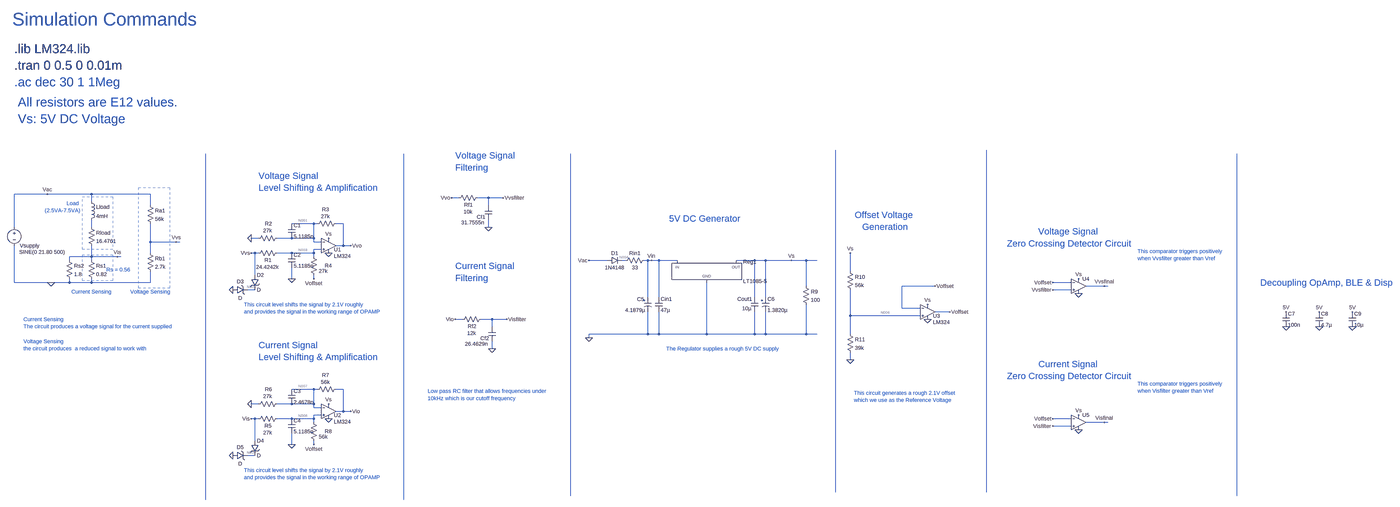
[diagram p0: schematic LTspice.asc, whole sheet]
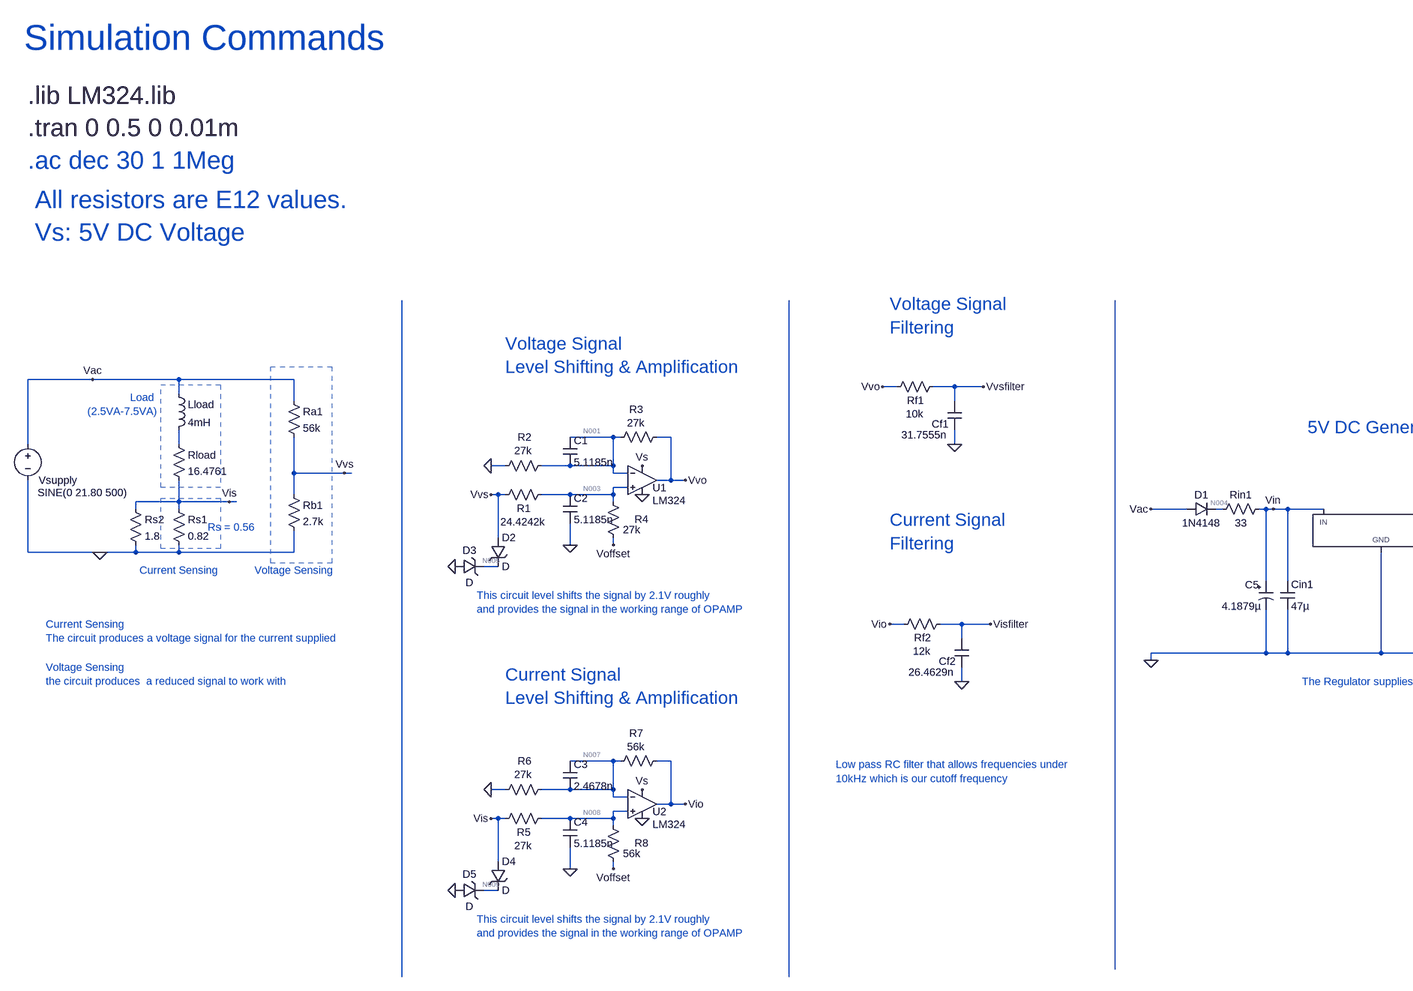
[diagram p1: schematic LTspice.asc, part, row 1 of 1, column 1 of 2]
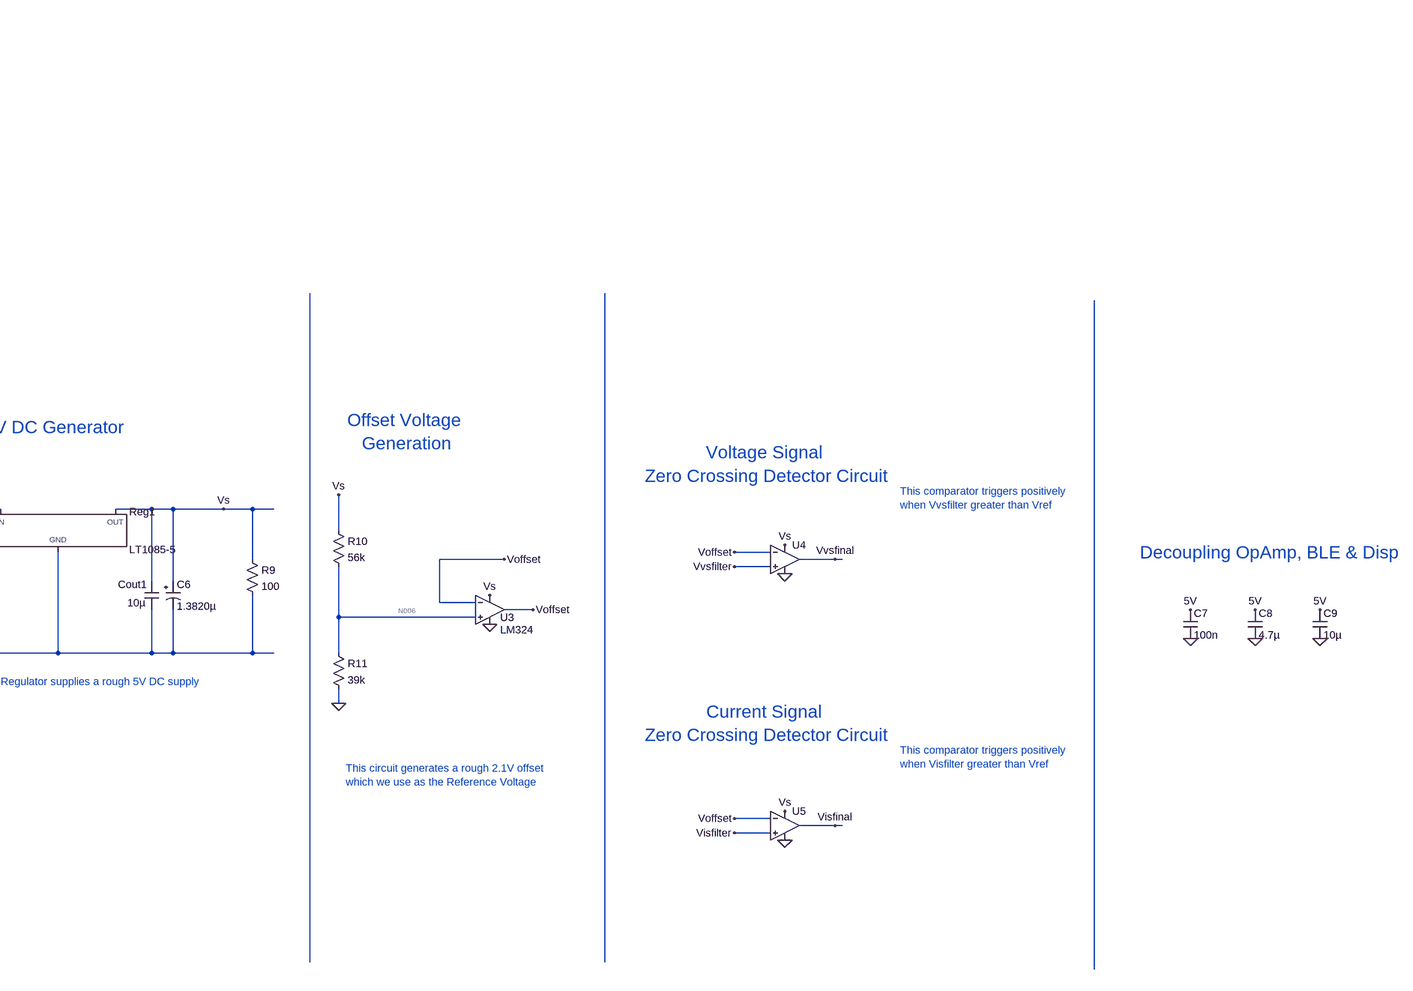
[diagram p2: schematic LTspice.asc, part, row 1 of 1, column 2 of 2]
LTspice.asc, the LTspice schematic file:
Version 4
SHEET 1 6052 1304
WIRE -96 -48 -240 -48
WIRE 96 -48 -96 -48
WIRE 352 -48 96 -48
WIRE 1856 -32 1824 -32
WIRE 1984 -32 1936 -32
WIRE 2048 -32 1984 -32
WIRE 96 -16 96 -48
WIRE 352 0 352 -48
WIRE 1984 0 1984 -32
WIRE 1072 80 976 80
WIRE 1088 80 1072 80
WIRE 1200 80 1168 80
WIRE -240 96 -240 -48
WIRE 96 96 96 64
WIRE 1984 96 1984 64
WIRE 832 144 800 144
WIRE 976 144 912 144
WIRE 1072 144 1072 80
WIRE 1072 144 976 144
WIRE 352 160 352 80
WIRE 464 160 352 160
WIRE 480 160 464 160
WIRE 1072 160 1072 144
WIRE 1104 160 1072 160
WIRE 1200 176 1200 80
WIRE 1200 176 1168 176
WIRE 1232 176 1200 176
WIRE 1104 192 1072 192
WIRE 352 208 352 160
WIRE 816 208 800 208
WIRE 832 208 816 208
WIRE 976 208 912 208
WIRE 1072 208 1072 192
WIRE 1072 208 976 208
WIRE 96 224 96 176
WIRE 96 224 0 224
WIRE 208 224 96 224
WIRE 224 224 208 224
WIRE 1072 224 1072 208
WIRE 0 240 0 224
WIRE 96 240 96 224
WIRE 2544 240 2464 240
WIRE 2624 240 2608 240
WIRE 2720 240 2704 240
WIRE 2736 240 2720 240
WIRE 2768 240 2736 240
WIRE 2848 240 2768 240
WIRE 3184 240 3104 240
WIRE 3232 240 3184 240
WIRE 3344 240 3232 240
WIRE 3408 240 3344 240
WIRE 3456 240 3408 240
WIRE 3600 288 3600 208
WIRE 816 304 816 208
WIRE 976 320 976 272
WIRE 1072 320 1072 304
WIRE -240 336 -240 176
WIRE -80 336 -240 336
WIRE 0 336 0 320
WIRE 0 336 -80 336
WIRE 96 336 96 320
WIRE 96 336 0 336
WIRE 352 336 352 288
WIRE 352 336 96 336
WIRE 4560 336 4480 336
WIRE 3408 352 3408 240
WIRE 3968 352 3824 352
WIRE 4704 352 4624 352
WIRE 4720 352 4704 352
WIRE 816 368 784 368
WIRE 4560 368 4480 368
WIRE 2720 400 2720 240
WIRE 2768 400 2768 240
WIRE 3184 400 3184 240
WIRE 3232 400 3232 240
WIRE 3824 448 3824 352
WIRE 3904 448 3824 448
WIRE 4032 464 3968 464
WIRE 3600 480 3600 368
WIRE 3904 480 3600 480
WIRE 1872 496 1840 496
WIRE 2000 496 1952 496
WIRE 2064 496 2000 496
WIRE 2000 528 2000 496
WIRE 2720 560 2720 464
WIRE 2720 560 2464 560
WIRE 2768 560 2768 464
WIRE 2768 560 2720 560
WIRE 2976 560 2976 336
WIRE 2976 560 2768 560
WIRE 3184 560 3184 464
WIRE 3184 560 2976 560
WIRE 3232 560 3232 464
WIRE 3232 560 3184 560
WIRE 3408 560 3408 432
WIRE 3408 560 3232 560
WIRE 3456 560 3408 560
WIRE 3600 560 3600 480
WIRE 2464 576 2464 560
WIRE 2000 624 2000 592
WIRE 3600 672 3600 640
WIRE 1072 800 976 800
WIRE 1088 800 1072 800
WIRE 1200 800 1168 800
WIRE 832 864 800 864
WIRE 976 864 912 864
WIRE 1072 864 1072 800
WIRE 1072 864 976 864
WIRE 1072 880 1072 864
WIRE 1104 880 1072 880
WIRE 1200 896 1200 800
WIRE 1200 896 1168 896
WIRE 1232 896 1200 896
WIRE 1104 912 1072 912
WIRE 816 928 800 928
WIRE 832 928 816 928
WIRE 976 928 912 928
WIRE 1072 928 1072 912
WIRE 1072 928 976 928
WIRE 4560 928 4480 928
WIRE 1072 944 1072 928
WIRE 4704 944 4624 944
WIRE 4720 944 4704 944
WIRE 4560 960 4480 960
WIRE 816 1024 816 928
WIRE 976 1040 976 992
WIRE 1072 1040 1072 1024
WIRE 816 1088 784 1088
WIRE 3536 1248 3536 -240
WIRE 4192 1248 4192 -240
WIRE 2384 1264 2384 -224
WIRE 5280 1264 5280 -224
WIRE 592 1280 592 -224
WIRE 1616 1280 1616 -224
FLAG -80 336 0
FLAG -96 -48 Vac
FLAG 208 224 Vis
FLAG 464 160 Vvs
FLAG 1136 208 0
FLAG 1136 144 Vs
FLAG 800 208 Vvs
FLAG 1072 320 Voffset
FLAG 800 144 0
FLAG 1232 176 Vvo
FLAG 1136 928 0
FLAG 1136 864 Vs
FLAG 800 928 Vis
FLAG 1072 1040 Voffset
FLAG 800 864 0
FLAG 1232 896 Vio
FLAG 1984 96 0
FLAG 1824 -32 Vvo
FLAG 2048 -32 Vvsfilter
FLAG 2000 624 0
FLAG 1840 496 Vio
FLAG 2064 496 Visfilter
FLAG 3600 208 Vs
FLAG 4592 384 0
FLAG 4592 320 Vs
FLAG 4480 368 Vvsfilter
FLAG 4480 336 Voffset
FLAG 4704 352 Vvsfinal
FLAG 2464 576 0
FLAG 2464 240 Vac
FLAG 3344 240 Vs
FLAG 2736 240 Vin
FLAG 3936 496 0
FLAG 3936 432 Vs
FLAG 3600 672 0
FLAG 4032 464 Voffset
FLAG 4592 976 0
FLAG 4592 912 Vs
FLAG 4480 960 Visfilter
FLAG 4480 928 Voffset
FLAG 4704 944 Visfinal
FLAG 3968 352 Voffset
FLAG 976 320 0
FLAG 976 1040 0
FLAG 720 368 0
FLAG 720 1088 0
FLAG 5504 528 0
FLAG 5648 528 0
FLAG 5792 528 0
FLAG 5504 464 5V
FLAG 5648 464 5V
FLAG 5792 464 5V
SYMBOL voltage -240 80 R0
WINDOW 0 24 96 Left 2
WINDOW 3 22 124 Left 2
WINDOW 123 0 0 Left 0
WINDOW 39 0 0 Left 0
SYMATTR InstName Vsupply
SYMATTR Value SINE(0 21.80 500)
SYMBOL res 80 80 R0
SYMATTR InstName Rload
SYMATTR Value 16.4761
SYMBOL ind 80 -32 R0
SYMATTR InstName Lload
SYMATTR Value 4mH
SYMBOL res 80 224 R0
SYMATTR InstName Rs1
SYMATTR Value 0.82
SYMBOL res 336 -16 R0
SYMATTR InstName Ra1
SYMATTR Value 56k
SYMBOL res 336 192 R0
SYMATTR InstName Rb1
SYMATTR Value 2.7k
SYMBOL Opamps/opamp2 1136 112 R0
WINDOW 0 23 81 Left 2
WINDOW 3 23 109 Left 2
SYMATTR InstName U1
SYMATTR Value LM324
SYMBOL res 928 192 R90
WINDOW 0 62 55 VBottom 2
WINDOW 3 61 57 VTop 2
SYMATTR InstName R1
SYMATTR Value 24.4242k
SYMBOL res 928 128 R90
WINDOW 0 -32 53 VBottom 2
WINDOW 3 -33 57 VTop 2
SYMATTR InstName R2
SYMATTR Value 27k
SYMBOL res 1184 64 R90
WINDOW 0 -30 61 VBottom 2
WINDOW 3 -31 62 VTop 2
SYMATTR InstName R3
SYMATTR Value 27k
SYMBOL res 1088 320 R180
WINDOW 0 -62 57 Left 2
WINDOW 3 -44 34 Left 2
SYMATTR InstName R4
SYMATTR Value 27k
SYMBOL Opamps/opamp2 1136 832 R0
WINDOW 0 23 81 Left 2
WINDOW 3 23 109 Left 2
SYMATTR InstName U2
SYMATTR Value LM324
SYMBOL res 928 912 R90
WINDOW 0 62 55 VBottom 2
WINDOW 3 61 57 VTop 2
SYMATTR InstName R5
SYMATTR Value 27k
SYMBOL res 928 848 R90
WINDOW 0 -32 53 VBottom 2
WINDOW 3 -33 57 VTop 2
SYMATTR InstName R6
SYMATTR Value 27k
SYMBOL res 1184 784 R90
WINDOW 0 -30 61 VBottom 2
WINDOW 3 -31 62 VTop 2
SYMATTR InstName R7
SYMATTR Value 56k
SYMBOL res 1088 1040 R180
WINDOW 0 -62 57 Left 2
WINDOW 3 -44 34 Left 2
SYMATTR InstName R8
SYMATTR Value 56k
SYMBOL res 1952 -48 R90
WINDOW 0 62 55 VBottom 2
WINDOW 3 61 57 VTop 2
SYMATTR InstName Rf1
SYMATTR Value 10k
SYMBOL cap 2000 64 R180
WINDOW 0 29 13 Left 2
WINDOW 3 33 -11 Left 2
SYMATTR InstName Cf1
SYMATTR Value 31.7555n
SYMBOL res 1968 480 R90
WINDOW 0 62 55 VBottom 2
WINDOW 3 61 57 VTop 2
SYMATTR InstName Rf2
SYMATTR Value 12k
SYMBOL cap 2016 592 R180
WINDOW 0 29 13 Left 2
WINDOW 3 33 -11 Left 2
SYMATTR InstName Cf2
SYMATTR Value 26.4629n
SYMBOL OpAmps/UniversalOpAmp2 4592 352 R0
SYMATTR InstName U4
SYMBOL PowerProducts/LT1085-5 2976 240 R0
SYMATTR InstName Reg1
SYMBOL res 2720 224 R90
WINDOW 0 0 56 VBottom 2
WINDOW 3 32 56 VTop 2
SYMATTR InstName Rin1
SYMATTR Value 33
SYMBOL diode 2544 256 R270
WINDOW 0 32 32 VTop 2
WINDOW 3 0 32 VBottom 2
SYMATTR InstName D1
SYMATTR Value 1N4148
SYMBOL cap 2752 400 R0
SYMATTR InstName Cin1
SYMATTR Value 47µ
SYMATTR SpiceLine Rser=0.001
SYMBOL cap 3168 400 R0
WINDOW 0 -59 8 Left 2
WINDOW 3 -38 49 Left 2
SYMATTR InstName Cout1
SYMATTR Value 10µ
SYMATTR SpiceLine Rser=0.001
SYMBOL res 3392 336 R0
SYMATTR InstName R9
SYMATTR Value 100
SYMBOL Opamps/opamp2 3936 400 R0
WINDOW 0 23 81 Left 2
WINDOW 3 23 109 Left 2
SYMATTR InstName U3
SYMATTR Value LM324
SYMBOL res 3584 272 R0
SYMATTR InstName R10
SYMATTR Value 56k
SYMBOL res 3584 544 R0
SYMATTR InstName R11
SYMATTR Value 39k
SYMBOL OpAmps/UniversalOpAmp2 4592 944 R0
SYMATTR InstName U5
SYMBOL cap 960 80 R0
SYMATTR InstName C1
SYMATTR Value 5.1185n
SYMBOL cap 960 208 R0
SYMATTR InstName C2
SYMATTR Value 5.1185n
SYMBOL res -16 224 R0
SYMATTR InstName Rs2
SYMATTR Value 1.8
SYMBOL cap 960 800 R0
SYMATTR InstName C3
SYMATTR Value 2.4678n
SYMBOL cap 960 928 R0
SYMATTR InstName C4
SYMATTR Value 5.1185n
SYMBOL polcap 2704 400 R0
WINDOW 0 -31 9 Left 2
WINDOW 3 -82 56 Left 2
SYMATTR InstName C5
SYMATTR Value 4.1879µ
SYMBOL polcap 3216 400 R0
SYMATTR InstName C6
SYMATTR Value 1.3820µ
SYMBOL zener 800 304 R0
SYMATTR InstName D2
SYMBOL zener 720 384 R270
WINDOW 0 36 32 VTop 2
WINDOW 3 -4 32 VBottom 2
SYMATTR InstName D3
SYMBOL zener 800 1024 R0
SYMATTR InstName D4
SYMBOL zener 720 1104 R270
WINDOW 0 36 32 VTop 2
WINDOW 3 -4 32 VBottom 2
SYMATTR InstName D5
SYMBOL cap 5488 464 R0
SYMATTR InstName C7
SYMATTR Value 100n
SYMBOL cap 5632 464 R0
SYMATTR InstName C8
SYMATTR Value 4.7µ
SYMBOL cap 5776 464 R0
SYMATTR InstName C9
SYMATTR Value 10µ
TEXT 48 -8 Right 2 ;Load \n(2.5VA-7.5VA)
TEXT -200 496 Left 2 ;Current Sensing                                \nThe circuit produces a voltage signal for the current supplied
TEXT -200 592 Left 2 ;Voltage Sensing\nthe circuit produces  a reduced signal to work with
TEXT 832 -128 Left 4 ;Voltage Signal \nLevel Shifting & Amplification
TEXT 768 432 Left 2 ;This circuit level shifts the signal by 2.1V roughly \nand provides the signal in the working range of OPAMP
TEXT 768 1152 Left 2 ;This circuit level shifts the signal by 2.1V roughly \nand provides the signal in the working range of OPAMP
TEXT 1840 -216 Left 4 ;Voltage Signal\nFiltering
TEXT 1840 264 Left 4 ;Current Signal\nFiltering
TEXT 1720 808 Left 2 ;Low pass RC filter that allows frequencies under \n10kHz which is our cutoff frequency
TEXT 3752 16 Top 4 ;Offset Voltage \nGeneration
TEXT 3616 816 Left 2 ;This circuit generates a rough 2.1V offset \nwhich we use as the Reference Voltage
TEXT 4552 88 Top 4 ;Voltage Signal \nZero Crossing Detector Circuit
TEXT 2968 32 Top 4 ;5V DC Generator
TEXT 2800 624 Left 2 ;The Regulator supplies a rough 5V DC supply
TEXT 8 376 Left 2 ;Current Sensing
TEXT 264 376 Left 2 ;Voltage Sensing
TEXT 832 608 Left 4 ;Current Signal \nLevel Shifting & Amplification
TEXT -248 -816 Left 6 ;Simulation Commands
TEXT -240 -688 Left 5 !.lib LM324.lib
TEXT -240 -616 Left 5 !.tran 0 0.5 0 0.01m
TEXT -240 -544 Left 5 ;.ac dec 30 1 1Meg
TEXT 4848 200 Left 2 ;This comparator triggers positively \nwhen Vvsfilter greater than Vref
TEXT 4848 776 Left 2 ;This comparator triggers positively \nwhen Visfilter greater than Vref
TEXT 4552 664 Top 4 ;Current Signal \nZero Crossing Detector Circuit
TEXT -224 -384 Left 5 ;Vs: 5V DC Voltage
TEXT -224 -456 Left 5 ;All resistors are E12 values.
TEXT 160 280 Left 2 ;Rs = 0.56
TEXT 5392 336 Left 4 ;Decoupling OpAmp, BLE & Disp
RECTANGLE Normal 300 -76 436 360 2
RECTANGLE Normal 56 -36 188 192 2
RECTANGLE Normal 56 216 188 328 2

The netlist it stands for:
* LTspice.asc
Vsupply Vac 0 SINE(0 21.80 500)
Rload N002 Vis 16.4761
Lload Vac N002 4mH
Rs1 Vis 0 0.82
Ra1 Vac Vvs 56k
Rb1 Vvs 0 2.7k
XU1 N003 N001 Vs 0 Vvo LM324  ; pins In+ In- V+ V- OUT
R1 N003 Vvs 24.4242k
R2 N001 0 27k
R3 Vvo N001 27k
R4 Voffset N003 27k
XU2 N008 N007 Vs 0 Vio LM324  ; pins In+ In- V+ V- OUT
R5 N008 Vis 27k
R6 N007 0 27k
R7 Vio N007 56k
R8 Voffset N008 56k
Rf1 Vvsfilter Vvo 10k
Cf1 0 Vvsfilter 31.7555n
Rf2 Visfilter Vio 12k
Cf2 0 Visfilter 26.4629n
XU4 Vvsfilter Voffset Vs 0 Vvsfinal level2 Avol=1Meg GBW=10Meg Slew=10Meg Ilimit=25m Rail=0 Vos=0 En=0 Enk=0 In=0 Ink=0 Rin=500Meg  ; pins In+ In- V+ V- OUT
XReg1 0 Vs Vin LT1085-5  ; pins GND OUT IN
Rin1 Vin N004 33
D1 Vac N004 1N4148
Cin1 Vin 0 47µ Rser=0.001
Cout1 Vs 0 10µ Rser=0.001
R9 Vs 0 100
XU3 N006 Voffset Vs 0 Voffset LM324  ; pins In+ In- V+ V- OUT
R10 Vs N006 56k
R11 N006 0 39k
XU5 Visfilter Voffset Vs 0 Visfinal level2 Avol=1Meg GBW=10Meg Slew=10Meg Ilimit=25m Rail=0 Vos=0 En=0 Enk=0 In=0 Ink=0 Rin=500Meg  ; pins In+ In- V+ V- OUT
C1 N001 N001 5.1185n
C2 N003 0 5.1185n
Rs2 Vis 0 1.8
C3 N007 N007 2.4678n
C4 N008 0 5.1185n
C5 Vin 0 4.1879µ
C6 Vs 0 1.3820µ
D2 Vvs N005 D
D3 0 N005 D
D4 Vis N009 D
D5 0 N009 D
C7 5V 0 100n
C8 5V 0 4.7µ
C9 5V 0 10µ
.model D D
.lib standard.dio
* Load
* (2.5VA-7.5VA)
* Current Sensing
* The circuit produces a voltage signal for the current supplied
* Voltage Sensing
* the circuit produces  a reduced signal to work with
* Voltage Signal
* Level Shifting & Amplification
* This circuit level shifts the signal by 2.1V roughly
* and provides the signal in the working range of OPAMP
* This circuit level shifts the signal by 2.1V roughly
* and provides the signal in the working range of OPAMP
* Voltage Signal
* Filtering
* Current Signal
* Filtering
* Low pass RC filter that allows frequencies under
* 10kHz which is our cutoff frequency
* Offset Voltage
* Generation
* This circuit generates a rough 2.1V offset
* which we use as the Reference Voltage
* Voltage Signal
* Zero Crossing Detector Circuit
* 5V DC Generator
* The Regulator supplies a rough 5V DC supply
* Current Sensing
* Voltage Sensing
* Current Signal
* Level Shifting & Amplification
* Simulation Commands
.lib LM324.lib
.tran 0 0.5 0 0.01m
* .ac dec 30 1 1Meg
* This comparator triggers positively
* when Vvsfilter greater than Vref
* This comparator triggers positively
* when Visfilter greater than Vref
* Current Signal
* Zero Crossing Detector Circuit
* Vs: 5V DC Voltage
* All resistors are E12 values.
* Rs = 0.56
* Decoupling OpAmp, BLE & Disp
.lib UniversalOpAmp2.lib
.backanno
.end

* Results of the author's LTspice run, read from the files saved beside the schematic
* Operating Point, zero values left out:
*   V(vis) = -1.035 µV
*   V(vvs) = -7.548 mV
*   V(vvo) = -158.8 mV
*   V(vs) = 1.182 V
*   V(n001) = -79.13 mV
*   V(n003) = -79.12 mV
*   V(voffset) = -158.8 mV
*   V(vio) = -158.8 mV
*   V(n007) = -51.29 mV
*   V(n008) = -51.29 mV
*   V(vvsfilter) = -158.8 mV
*   V(visfilter) = -158.8 mV
*   V(vvsfinal) = 1.959 mV
*   V(vin) = 1.178 V
*   V(n004) = 1.178 V
*   V(n006) = 485.4 mV
*   V(visfinal) = 4.638 mV
*   V(n005) = -3.697 mV
*   V(n009) = -517.3 nV
*   I(D1) = -2.521 nA
*   I(Lload) = 62.8 nA
*   I(Rload) = 62.8 nA
*   I(Rs1) = -1.262 µA
*   I(Ra1) = 134.8 nA
*   I(Rb1) = -2.795 µA
*   I(R1) = -2.93 µA
*   I(R2) = -2.931 µA
*   I(R3) = -2.951 µA
*   I(R4) = -2.95 µA
*   I(R5) = -1.899 µA
*   I(R6) = -1.9 µA
*   I(R7) = -1.92 µA
*   I(R8) = -1.919 µA
*   I(Rf1) = 1.5 nA
*   I(Rf2) = 1.5 nA
*   I(Rin1) = 2.521 nA
*   I(R9) = 11.82 mA
*   I(R10) = 12.45 µA
*   I(R11) = 12.45 µA
*   I(Rs2) = -574.8 nA
*   I(Vsupply) = -195.1 nA